# EAGLE schematic USB (EAGLE 8.1.0)
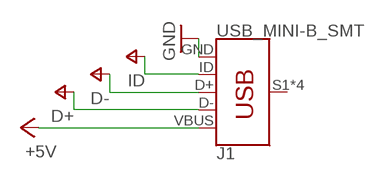
[diagram p0: schematic, sheet 1]

## Parts
J1  USB_MINI-B_SMT  [USB-MINIB]

## Nets
+5V: J1.VBUS
GND: J1.GND
V+: J1.D+ J1.D- J1.ID ; supply symbol labelled D+, D-, ID
Unconnected: J1.S1(SHIELD) J1.S2(SHIELD) J1.S3(SHIELD) J1.S4(SHIELD)

## Library data of the parts
J1 = SparkFun-Connectors:USB_MINI-B: USB type Mini-B Connector Breaks out 5th pin, and includes shield pins if needed. SparkFun Products: SparkFun FTDI Basic Breakout <https://www.sparkfun.com/products/9716> SparkFun XBee Explorer USB <https://www.sparkfun.com/products/11812> SparkFun Redboard <https://www.sparkfun.com/products/12757>; PROD_ID: CONN-08193; SF_ID: PRT-00587